# EAGLE design ha-led (EAGLE 9.6.2)
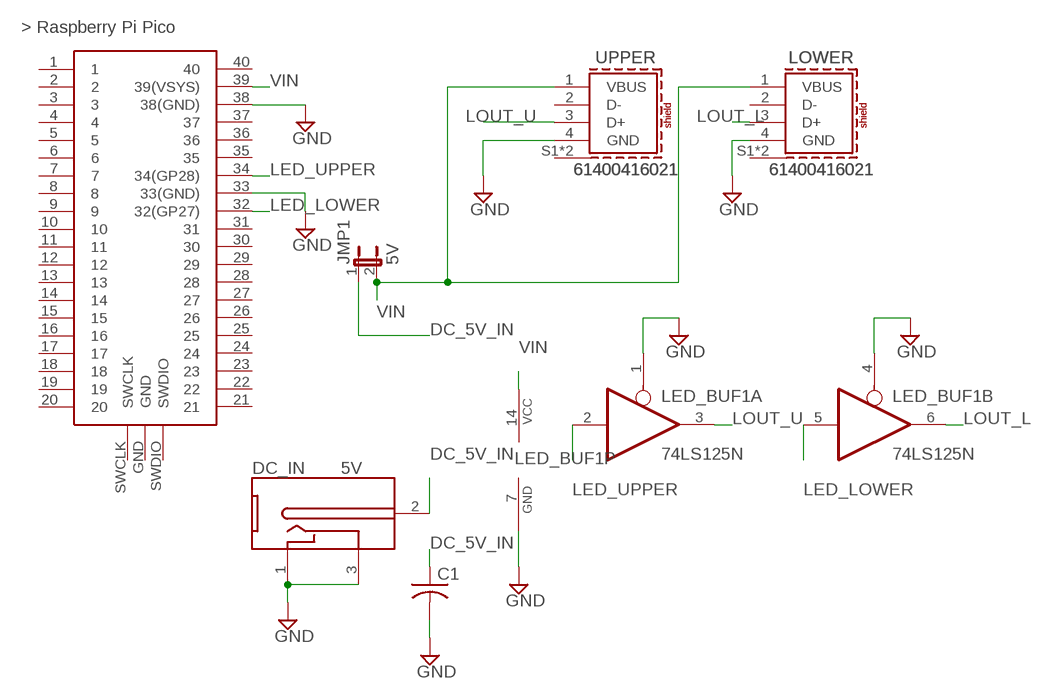
[diagram p0: schematic, sheet 1]

## Parts
C1  C-US025-030X050  [C025-030X050]
DC_IN  5V  DC-2.1MM-5MM  [DC-21MM]
JMP1  5V  JP1E  [JP1]
LED_BUF1  74LS125N  [DIL14]
LOWER  61400416021  61400416021  [61400416021]
U$1  RASPBERRY-PI-PICO_TH  [FT_RASPBERRY-PI-PICO_TH]
UPPER  61400416021  61400416021  [61400416021]

## Nets
DC_5V_IN: C1.1 DC_IN.2 JMP1.1
GND: C1.2 DC_IN.1 DC_IN.3 LED_BUF1.1(A:OE) LED_BUF1.4(B:OE) LED_BUF1.7(P:GND) LOWER.4(GND) U$1.33(33(GND)) U$1.38(38(GND)) UPPER.4(GND)
LED_LOWER: LED_BUF1.5(B:I) U$1.32(32(GP27))
LED_UPPER: LED_BUF1.2(A:I) U$1.34(34(GP28))
LOUT_L: LED_BUF1.6(B:O) LOWER.3(D+)
LOUT_U: LED_BUF1.3(A:O) UPPER.3(D+)
VIN: JMP1.2 LED_BUF1.14(P:VCC) LOWER.1(VBUS) U$1.39(39(VSYS)) UPPER.1(VBUS)
Unconnected: LED_BUF1.8(C:O) LED_BUF1.9(C:I) LED_BUF1.10(C:OE) LED_BUF1.11(D:O) LED_BUF1.12(D:I) LED_BUF1.13(D:OE) LOWER.2(D-) LOWER.S1(SHIELD) LOWER.S2(SHIELD) U$1.1 U$1.2 U$1.3 U$1.4 U$1.5 U$1.6 U$1.7 U$1.8 U$1.9 U$1.10 U$1.11 U$1.12 U$1.13 U$1.14 U$1.15 U$1.16 U$1.17 U$1.18 U$1.19 U$1.20 U$1.21 U$1.22 U$1.23 U$1.24 U$1.25 U$1.26 U$1.27 U$1.28 U$1.29 U$1.30 U$1.31 U$1.35 U$1.36 U$1.37 U$1.40 U$1.GND U$1.SWCLK U$1.SWDIO UPPER.2(D-) UPPER.S1(SHIELD) UPPER.S2(SHIELD)

## Library data of the parts
C1 = rcl:C-US: CAPACITOR, American symbol; SPICEPREFIX: C
DC_IN = power-jack:DC: 5mm x 2.1mm jack
JMP1 = jumper:JP1E: JUMPER
LED_BUF1 = 74xx-us:74*125: Quad bus BUFFER, 3-state
LOWER UPPER = Wurth_Connectors_WR-USB:61400416021: WR-COM USB 2.0 Type A Horizontal Kind Properties Durability:1 500 Mating cycles Quality Class:1 500 Mating cycles Connector Type:USB Gender:Receptacle Type:Horizontal General Information Operating Temperature:-40up to +105 °C Compliance:RoHS Electrical Properties IR 1:1.5 A Working Voltage:30V (AC) Withstanding Voltage:750 V (AC) Contact Resistance:20 mΩ Material Properties Insulator Material:PBT Insulator Flammability Rating:UL94 V-0 Color:White Cover Material:Brass Cover Plating:Nickel Contact Material:Copper Alloy Contact Plating:Selective Gold Contact Type:Stamped Shielding Material:Brass Shielding Plating:Nickel <https://www.we-online.com/catalog/media/o32983v209%20Family_WR-COM_61400416021.jpg> Details see: https://www.we-online.com/catalog/en/COM_TYPE_A_HORIZONTAL/ Updated by Yingchun, Shan 2020-01-14 2020 (C) Würth Elektronik; APPLICATION: USB 2.0; DATASHEET-URL: https://www.we-online.com/redexpert/spec/61400416021?ae; GERDER: Receptacle; INTERFACE-TYPE: Type A; IR: 1.5A; MOUNT: THT; PACKAGING: Tray; PART-NUMBER: 61400416021; PINS: 4; TYPE: Horizontal; WORKING-VOLTAGE: 30V(AC)
U$1 = pipico:RASPBERRY-PI-PICO_TH: Raspberry Pi Pico microcontroller board for through-hole mounting.

## Board
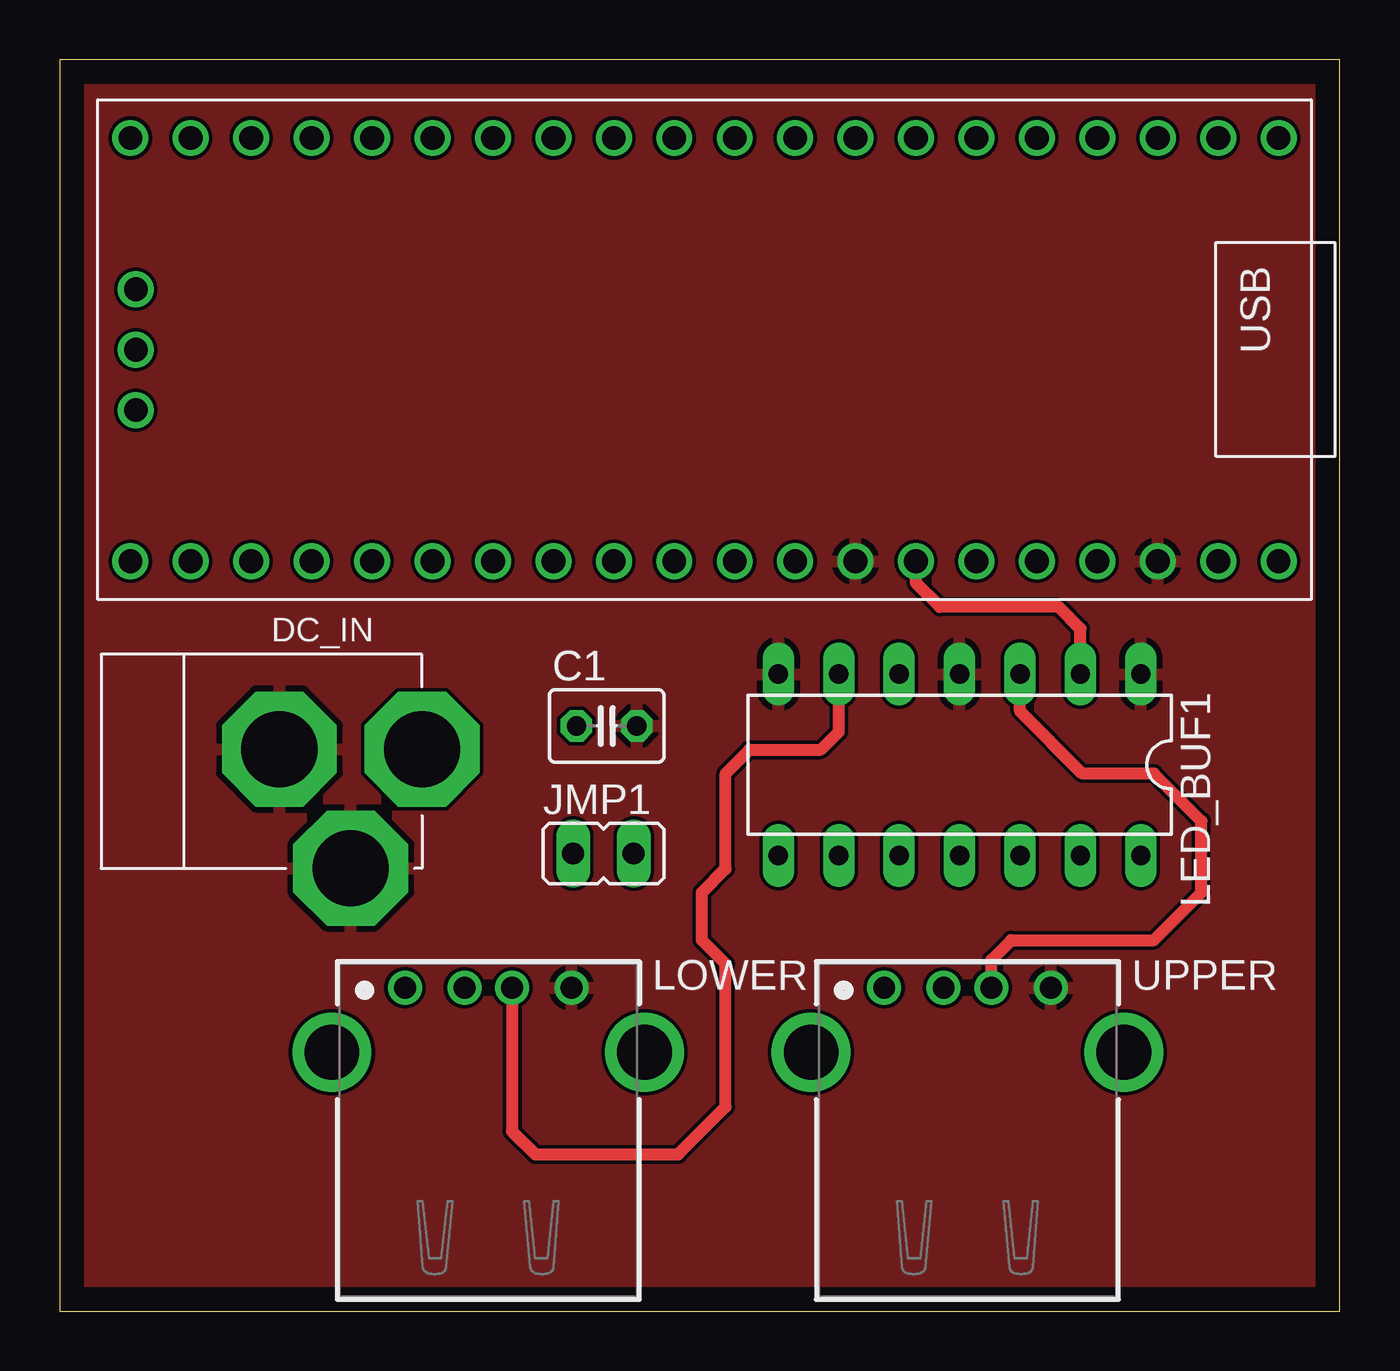
[diagram p1: board, top side]
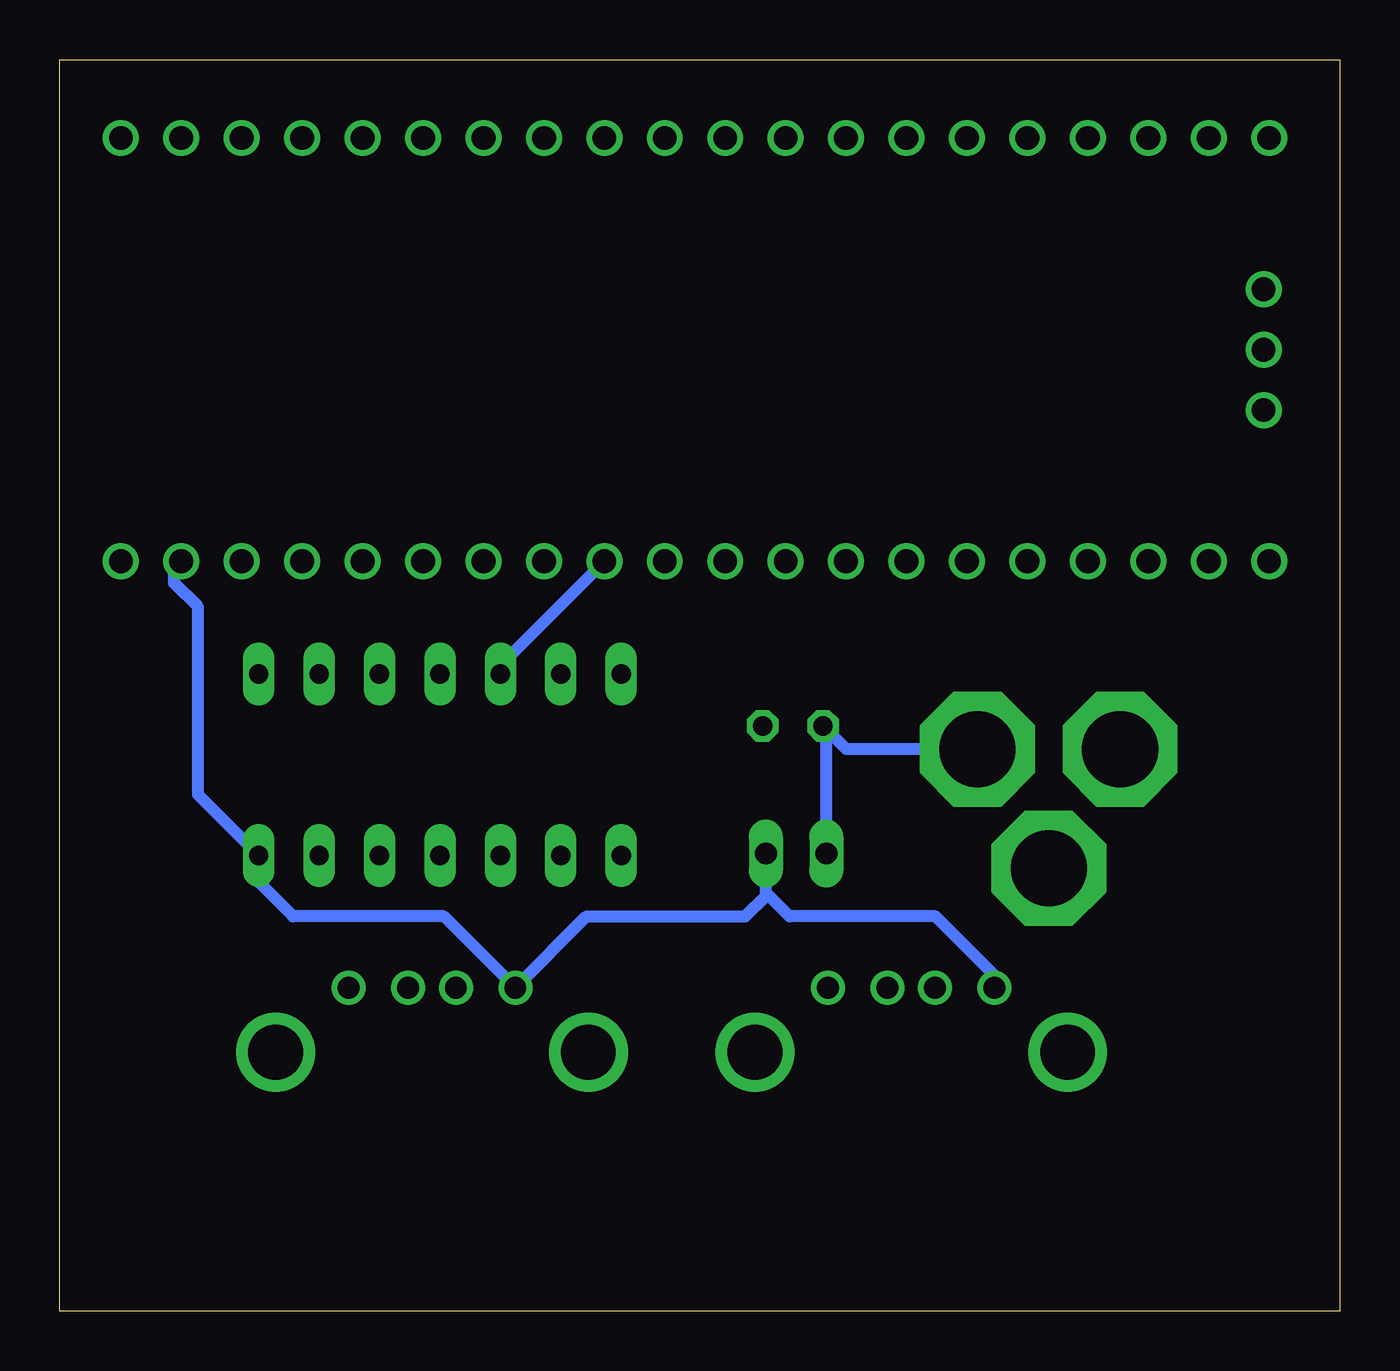
[diagram p2: board, bottom side, seen from below]

Size 53.82 x 52.6 mm. Coordinates in mm from the lower left corner, seen from the top.
Outline: 0,0 53.82,0 53.82,52.6 0,52.6 0,0
Copper layers (1*16): Top 0.035mm / dielectric 1.5mm / Bottom 0.035mm
Design rules "default": minimum track width 6mil, minimum drill 0.35mm, track to track 6mil, track to pad 6mil, pad to pad 6mil, via to via 6mil, smd to smd 6mil, copper to edge 40mil, drill to drill 6mil, minimum pad ring 10mil, minimum via ring 8mil, stop-mask expansion 4mil, vias tented up to drill 0mil, thermal gap 10mil

### Footprints (pad centres in the part's own frame; a part is rotated, then mirrored left to right if it is on the bottom)
C025-030X050 = drill 0.813 octagon: 1 -1.27,0; 2 1.27,0
DC-21MM = drill 3.2 pad 4.826 octagon: 1 -5.08,-3.353; 2 -0.076,-6.35; 3 -0.076,-0.356
JP1 = drill 0.914 long: 1 0,-1.27; 2 0,1.27
DIL14 = drill 0.813 long: 1 -7.62,-3.81; 2 -5.08,-3.81; 3 -2.54,-3.81; 4 0,-3.81; 5 2.54,-3.81; 6 5.08,-3.81; 7 7.62,-3.81; 8 7.62,3.81; 9 5.08,3.81; 10 2.54,3.81; 11 0,3.81; 12 -2.54,3.81; 13 -5.08,3.81; 14 -7.62,3.81
61400416021 = drill 0.92: 1 -3.5,5.99; 2 -1,5.99; 3 1,5.99; 4 3.5,5.99 | drill 2.3: S1 -6.57,3.28; S2 6.57,3.28
FT_RASPBERRY-PI-PICO_TH = drill 1: 1 -8.55,24.03; 2 -8.55,21.49; 3 -8.55,18.95; 4 -8.55,16.41; 5 -8.55,13.87; 6 -8.55,11.33; 7 -8.55,8.79; 8 -8.55,6.25; 9 -8.55,3.71; 10 -8.55,1.17; 11 -8.55,-1.37; 12 -8.55,-3.91; 13 -8.55,-6.45; 14 -8.55,-8.99; 15 -8.55,-11.53; 16 -8.55,-14.07; 17 -8.55,-16.61; 18 -8.55,-19.15; 19 -8.55,-21.69; 20 -8.55,-24.23; 21 9.23,-24.23; 22 9.23,-21.69; 23 9.23,-19.15; 24 9.23,-16.61; 25 9.23,-14.07; 26 9.23,-11.53; 27 9.23,-8.99; 28 9.23,-6.45; 29 9.23,-3.91; 30 9.23,-1.37; 31 9.23,1.17; 32 9.23,3.71; 33 9.23,6.25; 34 9.23,8.79; 35 9.23,11.33; 36 9.23,13.87; 37 9.23,16.41; 38 9.23,18.95; 39 9.23,21.49; 40 9.23,24.03; GND 0.34,-24; SWCLK -2.2,-24; SWDIO 2.88,-24

### Placement (x,y rotation side)
C1  23,24.6 0 top
DC_IN  8.89,23.7 90 top
JMP1  22.86,19.24 270 top
LED_BUF1  37.83,22.97 180 top
LOWER  18.02,7.61 0 top
U$1  27.21,40.75 270 top
UPPER  38.16,7.61 0 top

### Tracks (layer width: path | path; a pad name or v marks a point on that pad's centre or on a via)
DC_5V_IN
  Top 0.5: DC_IN.2 15.98,23.62
  Bottom 0.5: DC_IN.2 20.75,23.62 C1.1 21.59,24.46 JMP1.1
GND
  pour Top: 0,52.6 54,52.6 54,-0.4 0,-0.4
LED_LOWER
  Bottom 0.508: U$1.32 35.29,27.15 LED_BUF1.5
LED_UPPER
  Top 0.5: LED_BUF1.2 42.91,28.69 42,29.6 37,29.6 36,30.6 U$1.34
LOUT_L
  Top 0.5: LOWER.3 19.02,7.58 20,6.6 26,6.6 28,8.6 28,14.6 27,15.6 27,17.6 28,18.6 28,22.6 29,23.6 32,23.6 32.75,24.35 LED_BUF1.6
LOUT_U
  Top 0.5: UPPER.3 39.16,14.76 40,15.6 46,15.6 48,17.6 48,20.6 46,22.6 43,22.6 40.37,25.23 LED_BUF1.3
VIN
  Bottom 0.5: 24.13,17.6 24.13,17.47 25,16.6 31.66,16.6 UPPER.1 37.66,16.6 44,16.6 45.45,18.05 LED_BUF1.14 48,21.71 48,29.6 49,30.6 49,31.22 U$1.39 | 24.13,17.6 JMP1.2 | LOWER.1 14.52,14.12 17,16.6 23.13,16.6 24.13,17.6